# Altium schematic sheet Processor-LPC4330FBD144.SchDoc: Main Processor LPC43xx (144 TQFPT)
size C; DrawnBy: Adam Vadala-Roth; DocumentNumber: 2; Revision: 2.4b; SheetNumber: 2; SheetTotal: 9; PageSetup: Record=PageOptions|CenterHorizontal=True|CenterVertical=True|PrintScale=1.00|XCorrection=1.00|YCorrection=1.00|PrintKind=1|BorderSize=5000000|LeftOffset=0|BottomOffset=0|Orientation=2|PaperLength=1000|PaperWidth=1000|Scale=100|PaperSource=7|PrintQuality=-4|MediaType=1|DitherType=10|PaperKind=Letter|PrintScaleMode=0
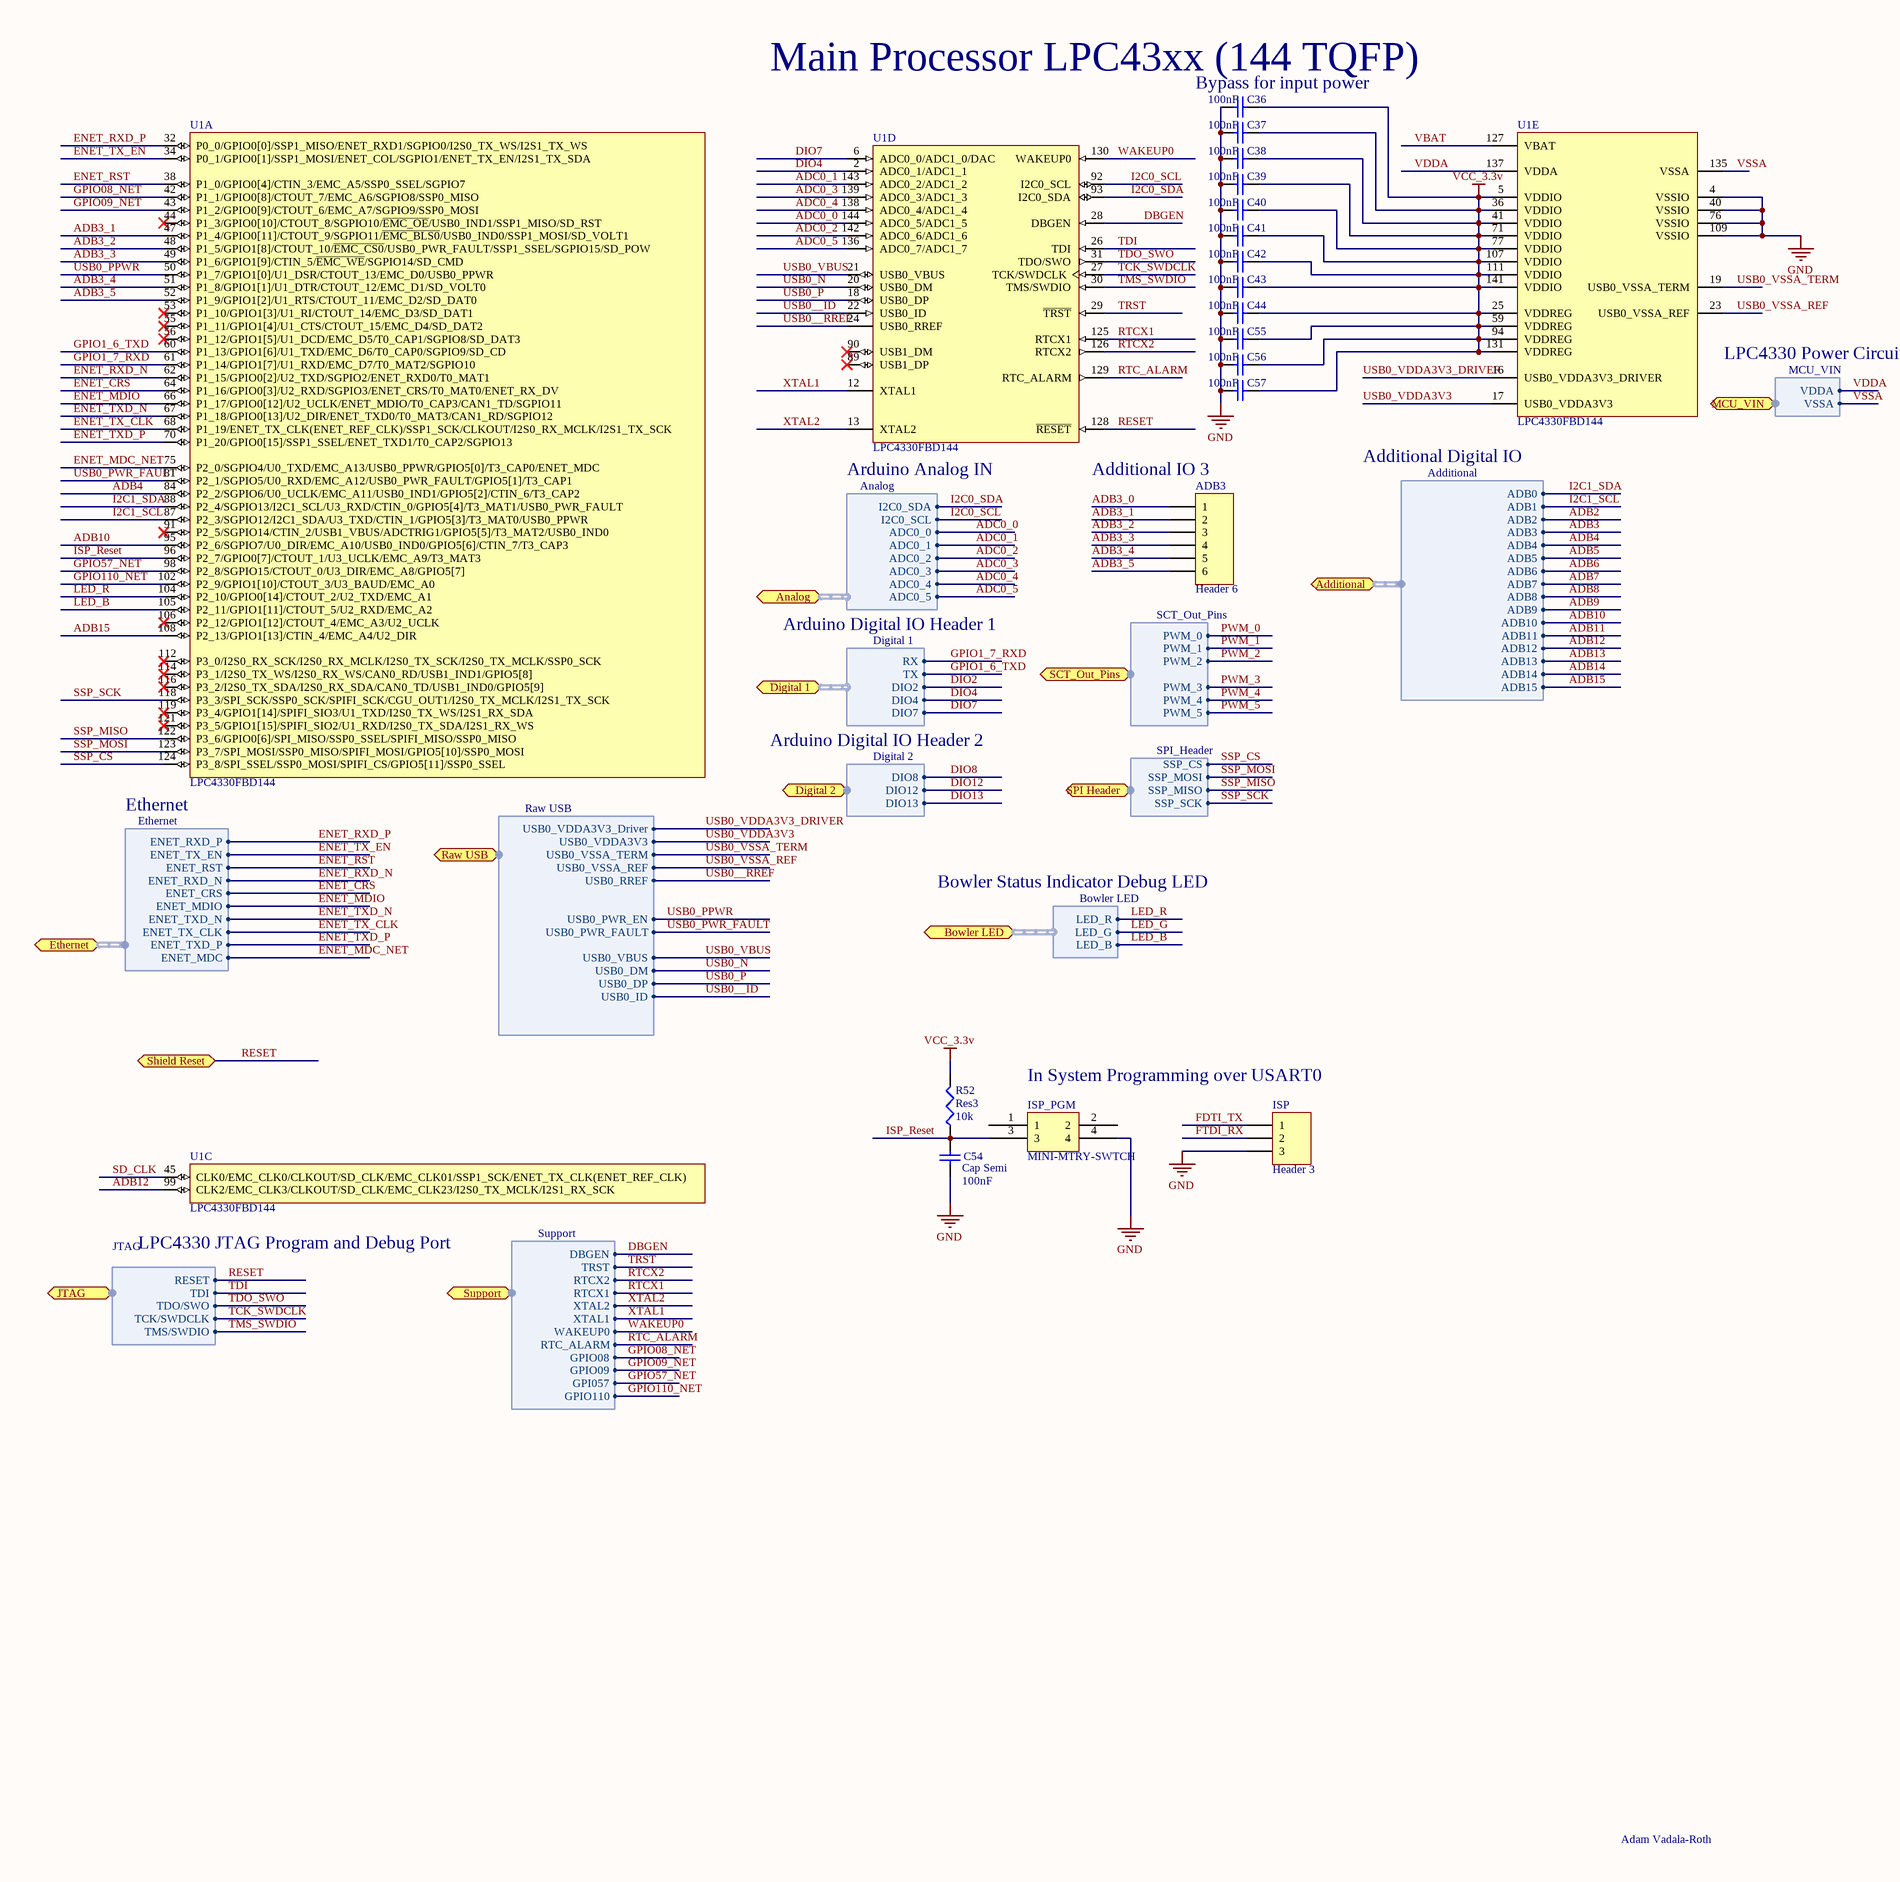
[diagram p0: Processor-LPC4330FBD144.SchDoc, left]
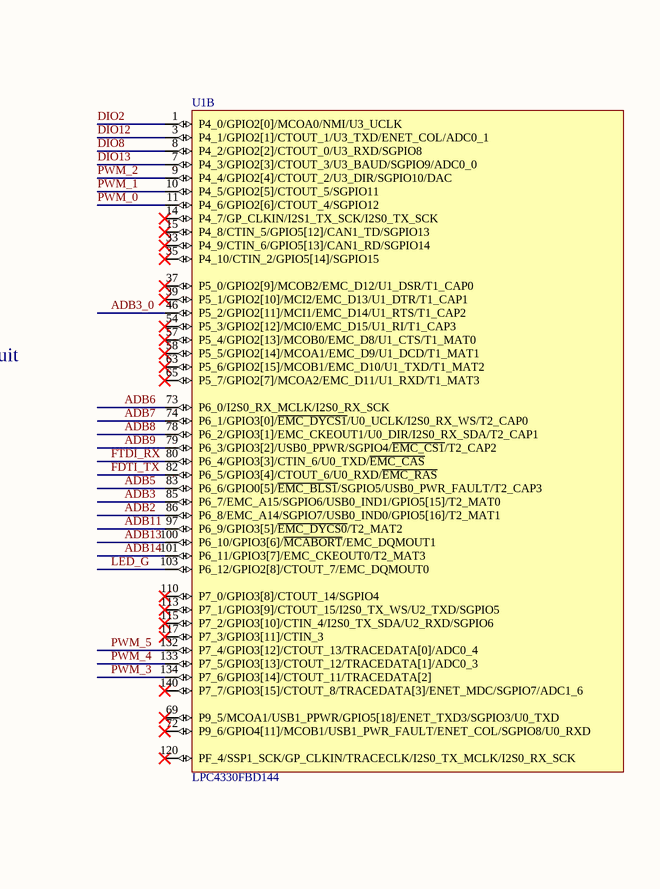
[diagram p1: Processor-LPC4330FBD144.SchDoc, right]

## Parts
ADB3  Header 6  [HDR1X6]
C36  value 100nF  [1608[0603]]  (hidden comment: Cap Semi)
C37  value 100nF  [1608[0603]]  (hidden comment: Cap Semi)
C38  value 100nF  [1608[0603]]  (hidden comment: Cap Semi)
C39  value 100nF  [1608[0603]]  (hidden comment: Cap Semi)
C40  value 100nF  [1608[0603]]  (hidden comment: Cap Semi)
C41  value 100nF  [1608[0603]]  (hidden comment: Cap Semi)
C42  value 100nF  [1608[0603]]  (hidden comment: Cap Semi)
C43  value 100nF  [1608[0603]]  (hidden comment: Cap Semi)
C44  value 100nF  [1608[0603]]  (hidden comment: Cap Semi)
C54  Cap Semi  C1: 100nF  [CAPC1608L]
C55  value 100nF  [1608[0603]]  (hidden comment: Cap Semi)
C56  value 100nF  [1608[0603]]  (hidden comment: Cap Semi)
C57  value 100nF  [1608[0603]]  (hidden comment: Cap Semi)
ISP  Header 3  [HDR1X3]
ISP_PGM  MINI-MTRY-SWTCH  [Momentary Switch]
R52  Res3  value 10k  [J1-0603]
U1  LPC4330FBD144  [SOT486-1_V]  (parts A,B,C,D,E of 5)

## Ports
Additional (harness Additional), Analog (harness Analog), Bowler LED (harness Bowler LED), Digital 1 (harness Digital 1), Digital 2 (harness Digital 2), Ethernet (harness Ethernet), JTAG (harness JTAG), MCU_VIN (harness MCU_VIN), Raw USB (harness Raw USB), SCT_Out_Pins (harness SCT_Out_Pins), Shield Reset, SPI Header (harness SPI_Header), Support (harness Support)

## Harnesses
Analog: ADC0_0, ADC0_1, ADC0_2, ADC0_3, ADC0_4, ADC0_5, I2C0_SCL, I2C0_SDA
Digital 1: TX, RX, DIO2, DIO4, DIO7
Digital 2: DIO8, DIO13, DIO12
MCU_VIN: VDDA, VSSA
Bowler LED: LED_R, LED_G, LED_B
SCT_Out_Pins: PWM_0, PWM_1, PWM_2, PWM_3, PWM_4, PWM_5
SPI_Header: SSP_CS, SSP_MOSI, SSP_MISO, SSP_SCK
JTAG: TDI, TDO/SWO, TCK/SWDCLK, TMS/SWDIO, RESET
Support: GPIO08, GPIO09, GPI057, GPIO110, RTC_ALARM, WAKEUP0, XTAL2, XTAL1, RTCX2, RTCX1, TRST, DBGEN
Additional: ADB0, ADB1, ADB2, ADB3, ADB4, ADB6, ADB5, ADB7, ADB9, ADB8, ADB10, ADB11, ADB12, ADB13, ADB14, ADB15
Raw USB: USB0_VDDA3V3_Driver, USB0_VDDA3V3, USB0_VSSA_TERM, USB0_VSSA_REF, USB0_VBUS, USB0_DP, USB0_DM, USB0_ID, USB0_RREF, USB0_PWR_EN, USB0_PWR_FAULT
Ethernet: ENET_RXD_P, ENET_TX_EN, ENET_RST, ENET_TXD_P, ENET_MDC, ENET_RXD_N, ENET_CRS, ENET_MDIO, ENET_TXD_N, ENET_TX_CLK

## Nets
GND: C36.2 C37.2 C38.2 C39.1 C40.2 C41.1 C42.2 C43.2 C44.2 C54.1 C55.2 C56.2 C57.2 ISP.3 ISP_PGM.4 U1.4(VSSIO) U1.40(VSSIO) U1.76(VSSIO) U1.109(VSSIO)
VCC_3.3v: C36.1 C37.1 C38.1 C39.2 C40.1 C41.2 C42.1 C43.1 C44.1 C55.1 C56.1 C57.1 R52.2 U1.5(VDDIO) U1.25(VDDREG) U1.36(VDDIO) U1.41(VDDIO) U1.59(VDDREG) U1.71(VDDIO) U1.77(VDDIO) U1.94(VDDREG) U1.107(VDDIO) U1.111(VDDIO) U1.131(VDDREG) U1.141(VDDIO)
ADB2: U1.86(P6_8/EMC_A14/SGPIO7/USB0_IND0/GPIO5[16]/T2_MAT1) ; port Additional.ADB2
ADB3: U1.85(P6_7/EMC_A15/SGPIO6/USB0_IND1/GPIO5[15]/T2_MAT0) ; port Additional.ADB3
ADB3_0: ADB3.1 U1.46(P5_2/GPIO2[11]/MCI1/EMC_D14/U1_RTS/T1_CAP2)
ADB3_1: ADB3.2 U1.47(P1_4/GPIO0[11]/CTOUT_9/SGPIO11/~{EMC_BLS0}/USB0_IND0/SSP1_MOSI/SD_VOLT1)
ADB3_2: ADB3.3 U1.48(P1_5/GPIO1[8]/CTOUT_10/~{EMC_CS0}/USB0_PWR_FAULT/SSP1_SSEL/SGPIO15/SD_POW)
ADB3_3: ADB3.4 U1.49(P1_6/GPIO1[9]/CTIN_5/~{EMC_WE}/SGPIO14/SD_CMD)
ADB3_4: ADB3.5 U1.51(P1_8/GPIO1[1]/U1_DTR/CTOUT_12/EMC_D1/SD_VOLT0)
ADB3_5: ADB3.6 U1.52(P1_9/GPIO1[2]/U1_RTS/CTOUT_11/EMC_D2/SD_DAT0)
ADB4: U1.84(P2_2/SGPIO6/U0_UCLK/EMC_A11/USB0_IND1/GPIO5[2]/CTIN_6/T3_CAP2) ; port Additional.ADB4
ADB5: U1.83(P6_6/GPIO0[5]/~{EMC_BLS1}/SGPIO5/USB0_PWR_FAULT/T2_CAP3) ; port Additional.ADB5
ADB6: U1.73(P6_0/I2S0_RX_MCLK/I2S0_RX_SCK) ; port Additional.ADB6
ADB7: U1.74(P6_1/GPIO3[0]/~{EMC_DYCS1}/U0_UCLK/I2S0_RX_WS/T2_CAP0) ; port Additional.ADB7
ADB8: U1.78(P6_2/GPIO3[1]/EMC_CKEOUT1/U0_DIR/I2S0_RX_SDA/T2_CAP1) ; port Additional.ADB8
ADB9: U1.79(P6_3/GPIO3[2]/USB0_PPWR/SGPIO4/~{EMC_CS1}/T2_CAP2) ; port Additional.ADB9
ADB10: U1.95(P2_6/SGPIO7/U0_DIR/EMC_A10/USB0_IND0/GPIO5[6]/CTIN_7/T3_CAP3) ; port Additional.ADB10
ADB11: U1.97(P6_9/GPIO3[5]/~{EMC_DYCS0}/T2_MAT2) ; port Additional.ADB11
ADB12: U1.99(CLK2/EMC_CLK3/CLKOUT/SD_CLK/EMC_CLK23/I2S0_TX_MCLK/I2S1_RX_SCK) ; port Additional.ADB12
ADB13: U1.100(P6_10/GPIO3[6]/~{MCABORT}/EMC_DQMOUT1) ; port Additional.ADB13
ADB14: U1.101(P6_11/GPIO3[7]/EMC_CKEOUT0/T2_MAT3) ; port Additional.ADB14
ADB15: U1.108(P2_13/GPIO1[13]/CTIN_4/EMC_A4/U2_DIR) ; port Additional.ADB15
ADC0_0: U1.144(ADC0_5/ADC1_5) ; port Analog.ADC0_0
ADC0_1: U1.143(ADC0_2/ADC1_2) ; port Analog.ADC0_1
ADC0_2: U1.142(ADC0_6/ADC1_6) ; port Analog.ADC0_2
ADC0_3: U1.139(ADC0_3/ADC1_3) ; port Analog.ADC0_3
ADC0_4: U1.138(ADC0_4/ADC1_4) ; port Analog.ADC0_4
ADC0_5: U1.136(ADC0_7/ADC1_7) ; port Analog.ADC0_5
DBGEN: U1.28(DBGEN) ; port Support.DBGEN
DIO2: U1.1(P4_0/GPIO2[0]/MCOA0/NMI/U3_UCLK) ; port Digital 1.DIO2
DIO4: U1.2(ADC0_1/ADC1_1) ; port Digital 1.DIO4
DIO7: U1.6(ADC0_0/ADC1_0/DAC) ; port Digital 1.DIO7
DIO8: U1.8(P4_2/GPIO2[2]/CTOUT_0/U3_RXD/SGPIO8) ; port Digital 2.DIO8
DIO12: U1.3(P4_1/GPIO2[1]/CTOUT_1/U3_TXD/ENET_COL/ADC0_1) ; port Digital 2.DIO12
DIO13: U1.7(P4_3/GPIO2[3]/CTOUT_3/U3_BAUD/SGPIO9/ADC0_0) ; port Digital 2.DIO13
ENET_CRS: U1.64(P1_16/GPIO0[3]/U2_RXD/SGPIO3/ENET_CRS/T0_MAT0/ENET_RX_DV) ; port Ethernet.ENET_CRS
ENET_MDC_NET: U1.75(P2_0/SGPIO4/U0_TXD/EMC_A13/USB0_PPWR/GPIO5[0]/T3_CAP0/ENET_MDC) ; port Ethernet.ENET_MDC
ENET_MDIO: U1.66(P1_17/GPIO0[12]/U2_UCLK/ENET_MDIO/T0_CAP3/CAN1_TD/SGPIO11) ; port Ethernet.ENET_MDIO
ENET_RST: U1.38(P1_0/GPIO0[4]/CTIN_3/EMC_A5/SSP0_SSEL/SGPIO7) ; port Ethernet.ENET_RST
ENET_RXD_N: U1.62(P1_15/GPIO0[2]/U2_TXD/SGPIO2/ENET_RXD0/T0_MAT1) ; port Ethernet.ENET_RXD_N
ENET_RXD_P: U1.32(P0_0/GPIO0[0]/SSP1_MISO/ENET_RXD1/SGPIO0/I2S0_TX_WS/I2S1_TX_WS) ; port Ethernet.ENET_RXD_P
ENET_TX_CLK: U1.68(P1_19/ENET_TX_CLK(ENET_REF_CLK)/SSP1_SCK/CLKOUT/I2S0_RX_MCLK/I2S1_TX_SCK) ; port Ethernet.ENET_TX_CLK
ENET_TX_EN: U1.34(P0_1/GPIO0[1]/SSP1_MOSI/ENET_COL/SGPIO1/ENET_TX_EN/I2S1_TX_SDA) ; port Ethernet.ENET_TX_EN
ENET_TXD_N: U1.67(P1_18/GPIO0[13]/U2_DIR/ENET_TXD0/T0_MAT3/CAN1_RD/SGPIO12) ; port Ethernet.ENET_TXD_N
ENET_TXD_P: U1.70(P1_20/GPIO0[15]/SSP1_SSEL/ENET_TXD1/T0_CAP2/SGPIO13) ; port Ethernet.ENET_TXD_P
FDTI_TX: ISP.1 U1.82(P6_5/GPIO3[4]/CTOUT_6/U0_RXD/~{EMC_RAS})
FTDI_RX: ISP.2 U1.80(P6_4/GPIO3[3]/CTIN_6/U0_TXD/~{EMC_CAS})
GPIO1_6_TXD: U1.60(P1_13/GPIO1[6]/U1_TXD/EMC_D6/T0_CAP0/SGPIO9/SD_CD) ; port Digital 1.TX
GPIO1_7_RXD: U1.61(P1_14/GPIO1[7]/U1_RXD/EMC_D7/T0_MAT2/SGPIO10) ; port Digital 1.RX
GPIO08_NET: U1.42(P1_1/GPIO0[8]/CTOUT_7/EMC_A6/SGPIO8/SSP0_MISO) ; port Support.GPIO08
GPIO09_NET: U1.43(P1_2/GPIO0[9]/CTOUT_6/EMC_A7/SGPIO9/SSP0_MOSI) ; port Support.GPIO09
GPIO57_NET: U1.98(P2_8/SGPIO15/CTOUT_0/U3_DIR/EMC_A8/GPIO5[7]) ; port Support.GPI057
GPIO110_NET: U1.102(P2_9/GPIO1[10]/CTOUT_3/U3_BAUD/EMC_A0) ; port Support.GPIO110
I2C0_SCL: U1.92(I2C0_SCL) ; port Analog.I2C0_SCL
I2C0_SDA: U1.93(I2C0_SDA) ; port Analog.I2C0_SDA
I2C1_SCL: U1.87(P2_3/SGPIO12/I2C1_SDA/U3_TXD/CTIN_1/GPIO5[3]/T3_MAT0/USB0_PPWR) ; port Additional.ADB1
I2C1_SDA: U1.88(P2_4/SGPIO13/I2C1_SCL/U3_RXD/CTIN_0/GPIO5[4]/T3_MAT1/USB0_PWR_FAULT) ; port Additional.ADB0
ISP_Reset: C54.2 ISP_PGM.3 R52.1 U1.96(P2_7/GPIO0[7]/CTOUT_1/U3_UCLK/EMC_A9/T3_MAT3)
LED_B: U1.105(P2_11/GPIO1[11]/CTOUT_5/U2_RXD/EMC_A2) ; port Bowler LED.LED_B
LED_G: U1.103(P6_12/GPIO2[8]/CTOUT_7/EMC_DQMOUT0) ; port Bowler LED.LED_G
LED_R: U1.104(P2_10/GPIO0[14]/CTOUT_2/U2_TXD/EMC_A1) ; port Bowler LED.LED_R
PWM_0: U1.11(P4_6/GPIO2[6]/CTOUT_4/SGPIO12) ; port SCT_Out_Pins.PWM_0
PWM_1: U1.10(P4_5/GPIO2[5]/CTOUT_5/SGPIO11) ; port SCT_Out_Pins.PWM_1
PWM_2: U1.9(P4_4/GPIO2[4]/CTOUT_2/U3_DIR/SGPIO10/DAC) ; port SCT_Out_Pins.PWM_2
PWM_3: U1.134(P7_6/GPIO3[14]/CTOUT_11/TRACEDATA[2]) ; port SCT_Out_Pins.PWM_3
PWM_4: U1.133(P7_5/GPIO3[13]/CTOUT_12/TRACEDATA[1]/ADC0_3) ; port SCT_Out_Pins.PWM_4
PWM_5: U1.132(P7_4/GPIO3[12]/CTOUT_13/TRACEDATA[0]/ADC0_4) ; port SCT_Out_Pins.PWM_5
RESET: U1.128(~{RESET}) ; port Shield Reset, port JTAG.RESET
RTC_ALARM: U1.129(RTC_ALARM) ; port Support.RTC_ALARM
RTCX1: U1.125(RTCX1) ; port Support.RTCX1
RTCX2: U1.126(RTCX2) ; port Support.RTCX2
SD_CLK: U1.45(CLK0/EMC_CLK0/CLKOUT/SD_CLK/EMC_CLK01/SSP1_SCK/ENET_TX_CLK(ENET_REF_CLK))
SSP_CS: U1.124(P3_8/SPI_SSEL/SSP0_MOSI/SPIFI_CS/GPIO5[11]/SSP0_SSEL) ; port SPI Header.SSP_CS
SSP_MISO: U1.122(P3_6/GPIO0[6]/SPI_MISO/SSP0_SSEL/SPIFI_MISO/SSP0_MISO) ; port SPI Header.SSP_MISO
SSP_MOSI: U1.123(P3_7/SPI_MOSI/SSP0_MISO/SPIFI_MOSI/GPIO5[10]/SSP0_MOSI) ; port SPI Header.SSP_MOSI
SSP_SCK: U1.118(P3_3/SPI_SCK/SSP0_SCK/SPIFI_SCK/CGU_OUT1/I2S0_TX_MCLK/I2S1_TX_SCK) ; port SPI Header.SSP_SCK
TCK_SWDCLK: U1.27(TCK/SWDCLK) ; port JTAG.TCK/SWDCLK
TDI: U1.26(TDI) ; port JTAG.TDI
TDO_SWO: U1.31(TDO/SWO) ; port JTAG.TDO/SWO
TMS_SWDIO: U1.30(TMS/SWDIO) ; port JTAG.TMS/SWDIO
TRST: U1.29(~{TRST}) ; port Support.TRST
USB0__ID: U1.22(USB0_ID) ; port Raw USB.USB0_ID
USB0__RREF: U1.24(USB0_RREF) ; port Raw USB.USB0_RREF
USB0_N: U1.20(USB0_DM) ; port Raw USB.USB0_DM
USB0_P: U1.18(USB0_DP) ; port Raw USB.USB0_DP
USB0_PPWR: U1.50(P1_7/GPIO1[0]/U1_DSR/CTOUT_13/EMC_D0/USB0_PPWR) ; port Raw USB.USB0_PWR_EN
USB0_PWR_FAULT: U1.81(P2_1/SGPIO5/U0_RXD/EMC_A12/USB0_PWR_FAULT/GPIO5[1]/T3_CAP1) ; port Raw USB.USB0_PWR_FAULT
USB0_VBUS: U1.21(USB0_VBUS) ; port Raw USB.USB0_VBUS
USB0_VDDA3V3: U1.17(USB0_VDDA3V3) ; port Raw USB.USB0_VDDA3V3
USB0_VDDA3V3_DRIVER: U1.16(USB0_VDDA3V3_DRIVER) ; port Raw USB.USB0_VDDA3V3_Driver
USB0_VSSA_REF: U1.23(USB0_VSSA_REF) ; port Raw USB.USB0_VSSA_REF
USB0_VSSA_TERM: U1.19(USB0_VSSA_TERM) ; port Raw USB.USB0_VSSA_TERM
VBAT: U1.127(VBAT)
VDDA: U1.137(VDDA) ; port MCU_VIN.VDDA
VSSA: U1.135(VSSA) ; port MCU_VIN.VSSA
WAKEUP0: U1.130(WAKEUP0) ; port Support.WAKEUP0
XTAL1: U1.12(XTAL1) ; port Support.XTAL1
XTAL2: U1.13(XTAL2) ; port Support.XTAL2

Not connected (* = marked no-connect by the designer): ISP_PGM 1 2; U1 14(P4_7/GP_CLKIN/I2S1_TX_SCK/I2S0_TX_SCK)* 15(P4_8/CTIN_5/GPIO5[12]/CAN1_TD/SGPIO13)* 33(P4_9/CTIN_6/GPIO5[13]/CAN1_RD/SGPIO14)* 35(P4_10/CTIN_2/GPIO5[14]/SGPIO15)* 37(P5_0/GPIO2[9]/MCOB2/EMC_D12/U1_DSR/T1_CAP0)* 39(P5_1/GPIO2[10]/MCI2/EMC_D13/U1_DTR/T1_CAP1)* 44(P1_3/GPIO0[10]/CTOUT_8/SGPIO10/~{EMC_OE}/USB0_IND1/SSP1_MISO/SD_RST)* 53(P1_10/GPIO1[3]/U1_RI/CTOUT_14/EMC_D3/SD_DAT1)* 54(P5_3/GPIO2[12]/MCI0/EMC_D15/U1_RI/T1_CAP3)* 55(P1_11/GPIO1[4]/U1_CTS/CTOUT_15/EMC_D4/SD_DAT2)* 56(P1_12/GPIO1[5]/U1_DCD/EMC_D5/T0_CAP1/SGPIO8/SD_DAT3)* 57(P5_4/GPIO2[13]/MCOB0/EMC_D8/U1_CTS/T1_MAT0)* 58(P5_5/GPIO2[14]/MCOA1/EMC_D9/U1_DCD/T1_MAT1)* 63(P5_6/GPIO2[15]/MCOB1/EMC_D10/U1_TXD/T1_MAT2)* 65(P5_7/GPIO2[7]/MCOA2/EMC_D11/U1_RXD/T1_MAT3)* 69(P9_5/MCOA1/USB1_PPWR/GPIO5[18]/ENET_TXD3/SGPIO3/U0_TXD)* 72(P9_6/GPIO4[11]/MCOB1/USB1_PWR_FAULT/ENET_COL/SGPIO8/U0_RXD)* 89(USB1_DP)* 90(USB1_DM)* 91(P2_5/SGPIO14/CTIN_2/USB1_VBUS/ADCTRIG1/GPIO5[5]/T3_MAT2/USB0_IND0)* 106(P2_12/GPIO1[12]/CTOUT_4/EMC_A3/U2_UCLK)* 110(P7_0/GPIO3[8]/CTOUT_14/SGPIO4)* 112(P3_0/I2S0_RX_SCK/I2S0_RX_MCLK/I2S0_TX_SCK/I2S0_TX_MCLK/SSP0_SCK)* 113(P7_1/GPIO3[9]/CTOUT_15/I2S0_TX_WS/U2_TXD/SGPIO5)* 114(P3_1/I2S0_TX_WS/I2S0_RX_WS/CAN0_RD/USB1_IND1/GPIO5[8])* 115(P7_2/GPIO3[10]/CTIN_4/I2S0_TX_SDA/U2_RXD/SGPIO6)* 116(P3_2/I2S0_TX_SDA/I2S0_RX_SDA/CAN0_TD/USB1_IND0/GPIO5[9])* 117(P7_3/GPIO3[11]/CTIN_3)* 119(P3_4/GPIO1[14]/SPIFI_SIO3/U1_TXD/I2S0_TX_WS/I2S1_RX_SDA)* 120(PF_4/SSP1_SCK/GP_CLKIN/TRACECLK/I2S0_TX_MCLK/I2S0_RX_SCK)* 121(P3_5/GPIO1[15]/SPIFI_SIO2/U1_RXD/I2S0_TX_SDA/I2S1_RX_WS)* 140(P7_7/GPIO3[15]/CTOUT_8/TRACEDATA[3]/ENET_MDC/SGPIO7/ADC1_6)*

## Notes on the sheet
- (near C36) Main Processor LPC43xx (144 TQFP)
- (near C36) Bypass for input power
- (near U1) LPC4330 Power Circuit
- (near U1) Additional Digital IO
- (near U1) Arduino Analog IN
- Additional IO 3
- Arduino Digital IO Header 1
- Arduino Digital IO Header 2
- (near U1) Ethernet
- Bowler Status Indicator Debug LED
- In System Programming over USART0
- (near U1) LPC4330 JTAG Program and Debug Port
- Adam Vadala-Roth
- Title
- Size:
- Date:
- B
- Number:
- Time:
- Revision:
- Sheet
- of
- File:

## Library data of the parts
ADB3 = Header 6: Header, 6-Pin; LatestRevisionDate: 17-Jul-2002; LatestRevisionNote: Re-released for DXP Platform.; Publisher: Altium Limited
C36-C44 C54-C57 = Cap Semi: Capacitor (Semiconductor SIM Model); Published: 8-Jun-2000; LatestRevisionDate: 29-May-2009; LatestRevisionNote: IPC-7351 Footprint Added.; PackageReference: C1206; Publisher: Altium Limited; PackageDescription: Chip Capacitor
ISP = Header 3: Header, 3-Pin; LatestRevisionDate: 17-Jul-2002; LatestRevisionNote: Re-released for DXP Platform.; Publisher: Altium Limited
ISP_PGM = Mini Momemtary Switch
R52 = Res3: Resistor; Published: 8-Jun-2000; LatestRevisionDate: 29-May-2009; LatestRevisionNote: IPC-7351 Footprint Added.; PackageReference: J1-0603; Publisher: Altium Limited; PackageDescription: Chip Resistor
U1 = LPC4330FBD144: 32-bit ARM Cortex-M4 MCU, 264 kB SRAM, 2 HS USB with on-chip PHY, Ethernet, CAN, AES, SPIFI, SGPIO, SCT, 144-Pin LQFP; fmax: 204 MHz; GPIOs: 83; SRAM: 264 kB; ROM: 64 kB; Ethernet: Y; USB: 2; ADC channels: 8; SPI: 1; UART: 4; VDD (min): 2.2 V; VDD (max): 3.6 V; Code_IEC: 136E23; DatasheetVersion: Rev.3.1, Jan-2012; PackageVersion: Feb-2003; PackageReference: SOT486-1; PackageDescription: LQFP144: Plastic Low Profile Quad Flat Package; 144 Leads; Body 20 x 20 x 1.4 mm; PWM: Y; PLL: Y; I2C: 2; CAN: 2; Timers: 4; Code_JEDEC: MS-026; ComponentLink1Description: Manufacturer URL; ComponentLink1URL: http://www.nxp.com/; ComponentLink2Description: Datasheet; ComponentLink2URL: http://www.nxp.com/documents/data_sheet/LPC4350_30_20_10.pdf